# EAGLE design 20w_Adapter (EAGLE 9.4.2)
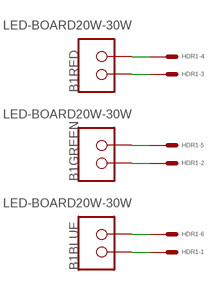
[diagram p0: schematic, sheet 1]

## Parts
B1  LED-BOARD20W-30W  [LED_BOARD_LRG]
HDR1  M06LOCK  [1X06_LOCK]

## Nets
N$1: B1.R- B1.R-@1 HDR1.4
N$2: B1.R+ B1.R+@1 HDR1.3
N$3: B1.G- B1.G-@1 HDR1.5
N$4: B1.G+ B1.G+@1 HDR1.2
N$5: B1.B- B1.B-@1 HDR1.6
N$6: B1.B+ B1.B+@2 HDR1.1

## Library data of the parts
B1 = myBoards:LED-BOARD
HDR1 = headers:M06: Header 6 Standard 6-pin 0.1" header. Use with straight break away headers (SKU : PRT-00116), right angle break away headers (PRT-00553), swiss pins (PRT-00743), machine pins (PRT-00117), and female headers (PRT-00115). Molex polarized connector foot print use with SKU : PRT-08094 with associated crimp pins and housings. NOTES ON THE VARIANTS LOCK and LOCK_LONGPADS... This footprint was designed to help hold the alignment of a through-hole component (i.e. 6-pin header) while soldering it into place. You may notice that each hole has been shifted either up or down by 0.005 of an inch from it's more standard position (which is a perfectly straight line). This slight alteration caused the pins (the squares in the middle) to touch the edges of the holes. Because they are alternating, it causes a "brace" to hold the component in place. 0.005 has proven to be the perfect amount of "off-center" position when using our standard breakaway headers. Although looks a little odd when you look at the bare footprint, once you have a header in there, the alteration is very hard to notice. Also, if you push a header all the way into place, it is covered up entirely on the bottom side. This idea of altering the position of holes to aid alignment will be further integrated into the Sparkfun Library for other footprints. It can help hold any component with 3 or more connection pins.

## Board
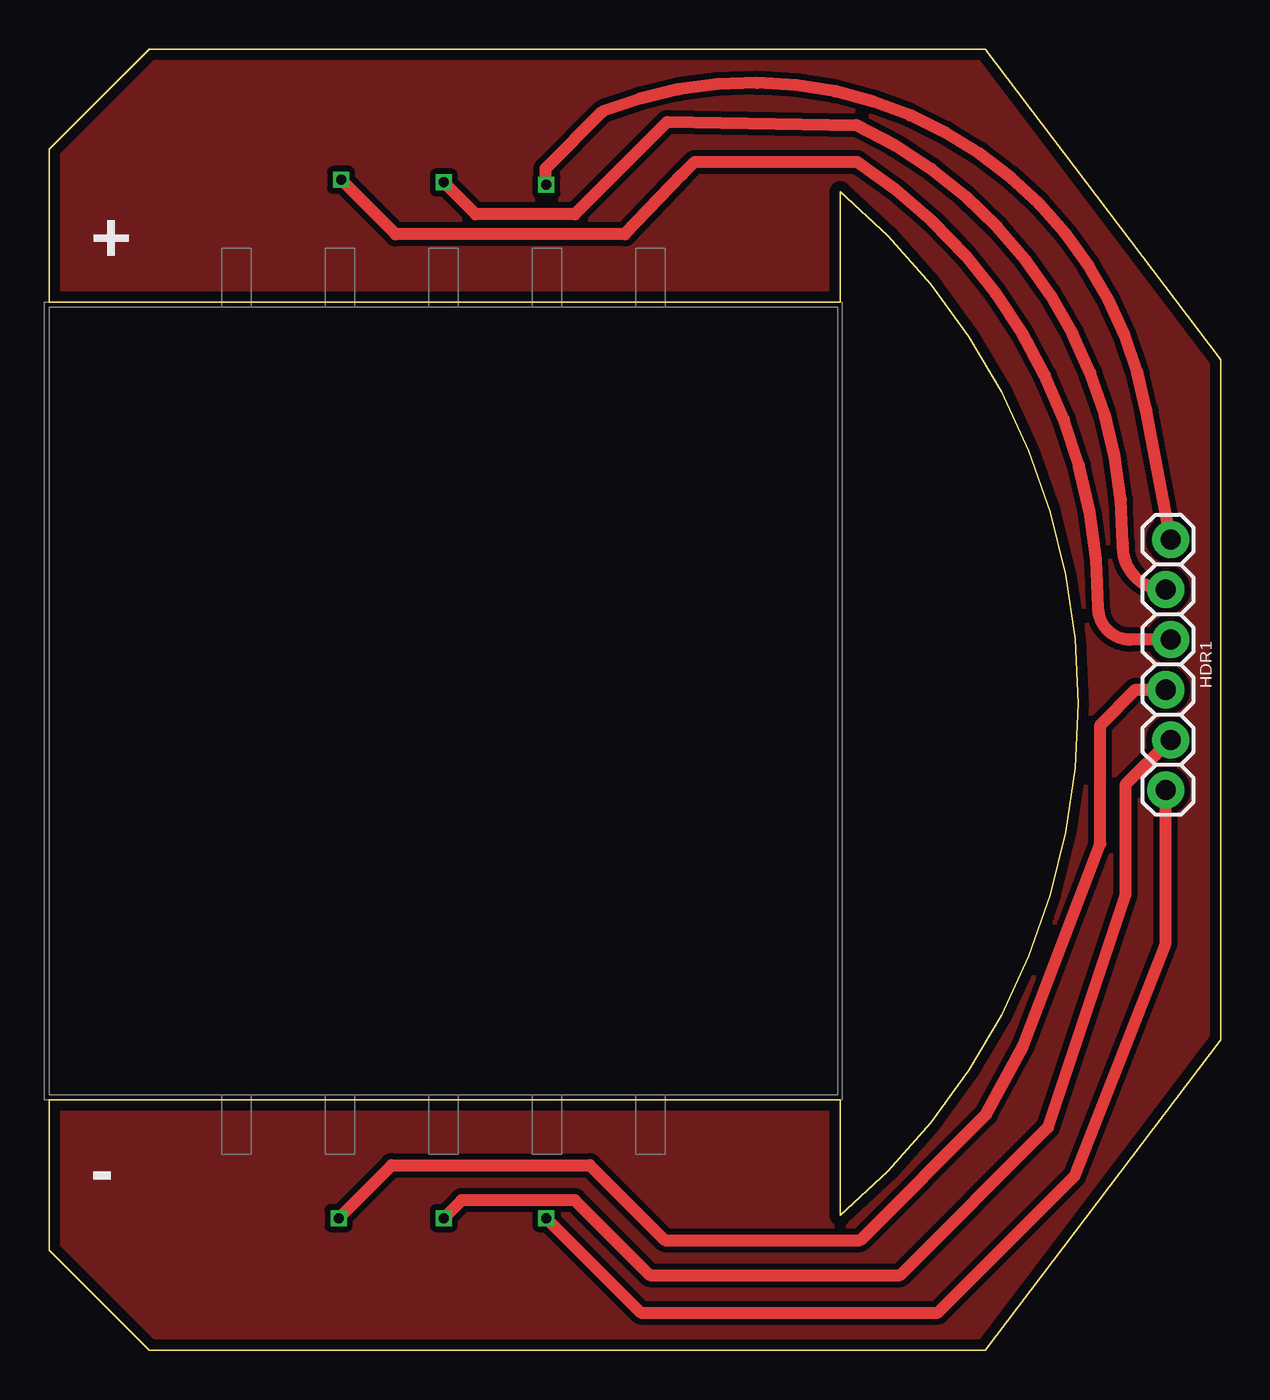
[diagram p1: board, top side]
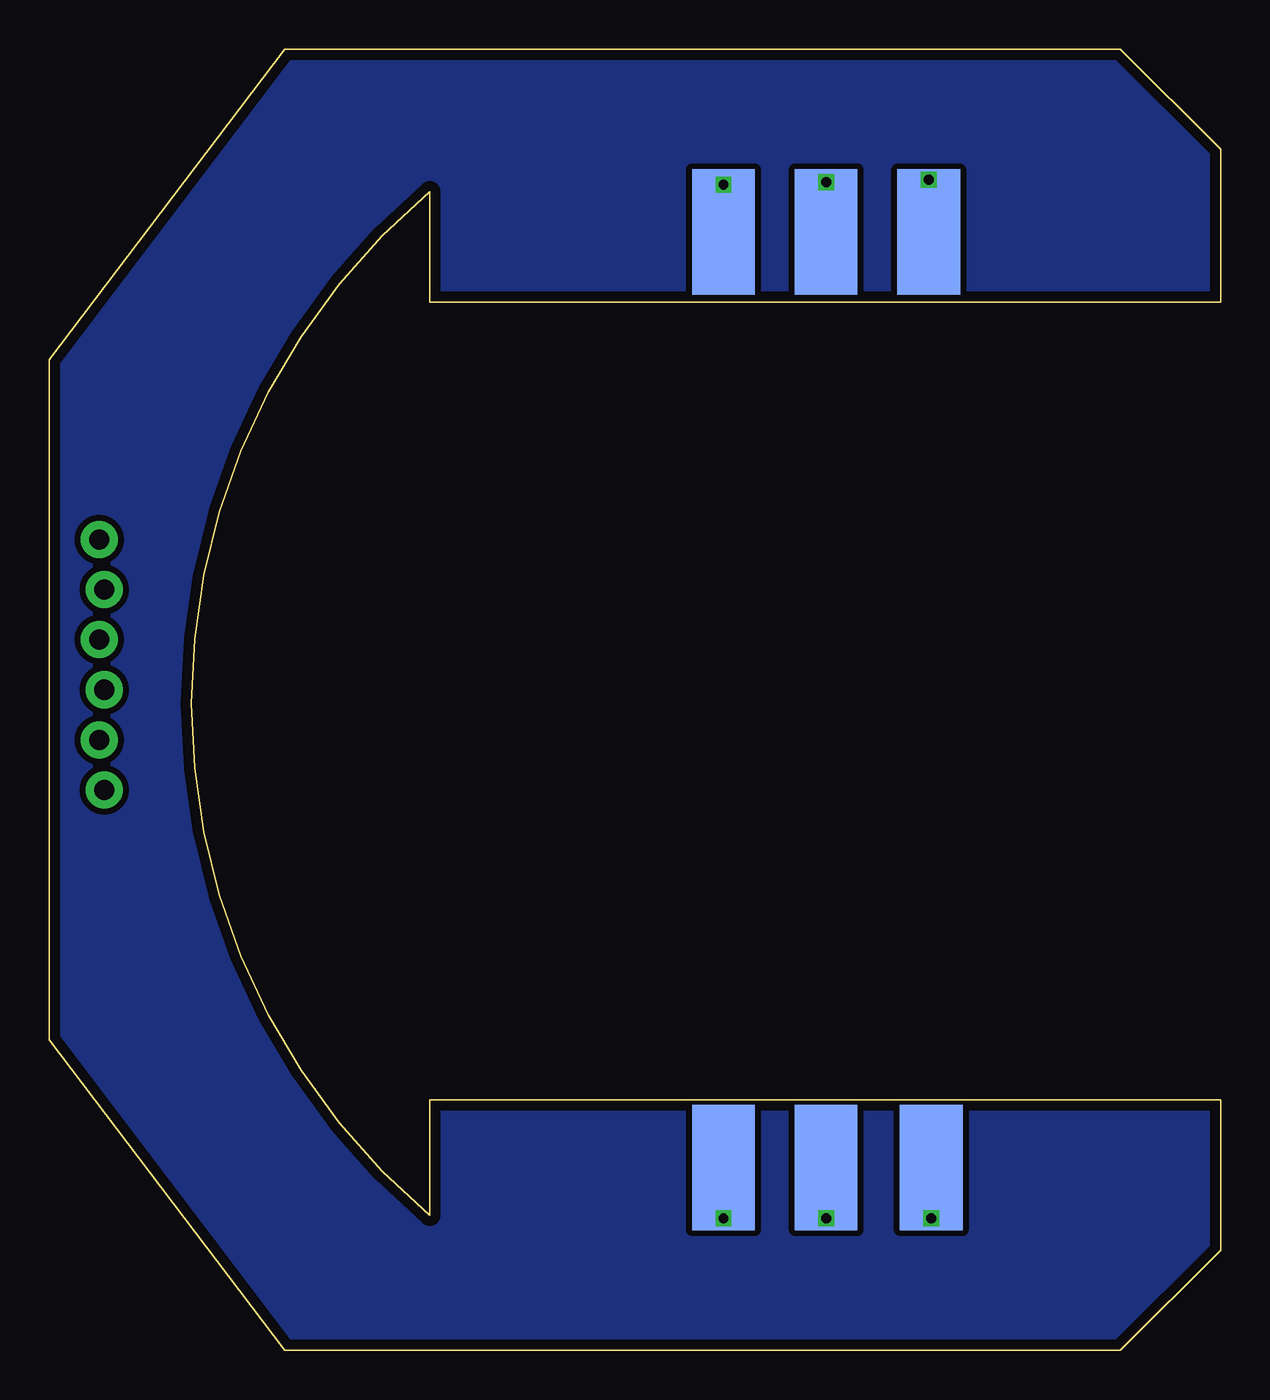
[diagram p2: board, bottom side, seen from below]

Size 59.44 x 66.04 mm. Coordinates in mm from the lower left corner, seen from the top.
Outline: 5.08,0 0,5.08 0,12.7 40.13,12.7 40.13,6.86 arc100 40.13,58.8 40.13,53.21 0,53.21 0,60.96 5.08,66.04 47.5,66.04 59.44,50.29 59.44,15.75 47.5,0 5.08,0
Copper layers (1*16): Top 0.035mm / dielectric 1.6mm / Bottom 0.035mm
Design rules "Elecrow_2-layer_PCB_eagle_rule": minimum track width 6mil, minimum drill 12mil, track to track 6mil, track to pad 6mil, pad to pad 6mil, via to via 8mil, smd to smd 6mil, copper to edge 20mil, drill to drill 10mil, minimum pad ring 6mil, minimum via ring 6mil, stop-mask expansion 0mil, vias tented up to drill 100mil, thermal gap 10mil

### Footprints (pad centres in the part's own frame; a part is rotated, then mirrored left to right if it is on the bottom)
LED_BOARD_LRG = smd 3.175 x 6.35 bottom: B+ 25.222,56.769; B- 25.222,9.271; G+ 20.015,56.769; G- 20.015,9.271; R+ 14.808,56.769; R- 14.681,9.271 | drill 0.5 square: B+@2 25.222,59.157; B-@1 25.222,6.706; G+@1 20.015,59.284; G-@1 20.015,6.706; R+@1 14.808,59.411; R-@1 14.681,6.706
1X06_LOCK = drill 1.016 pad 1.88: 1 -6.35,0; 2 -3.81,-0.254; 3 -1.27,0; 4 1.27,-0.254; 5 3.81,0; 6 6.35,-0.254

### Placement (x,y rotation side)
B1  0,0 0 top
HDR1  56.9,34.8 270 top

### Tracks (layer width: path | path; a pad name or v marks a point on that pad's centre or on a via)
GND
  pour Top (isolate 0.305): 5.08,0 0,5.08 0,12.7 40.13,12.7 40.13,6.86 43.05,9.65 44.7,11.43 45.72,12.83 46.61,14.1 48.77,17.91 49.78,20.32 50.55,22.23 51.56,26.04 51.94,28.96 52.2,31.24 52.2,35.18 51.94,37.72 50.93,42.16 50.04,44.83 48.64,48.01 47.62,49.78 45.59,52.96 43.69,55.37 40.51,58.55 40.13,58.8 40.13,53.21 0,53.21 0,60.96 5.08,66.04 47.5,66.04 59.44,50.42 59.44,15.49 47.5,0
  pour Bottom (isolate 0.305): 5.08,0 0,5.08 0,12.7 40.13,12.7 40.13,6.86 43.05,9.65 44.7,11.43 45.72,12.83 46.61,14.1 48.77,17.91 49.78,20.32 50.55,22.23 51.56,26.04 51.94,28.96 52.2,31.24 52.2,35.18 51.94,37.72 50.93,42.16 50.04,44.83 48.64,48.01 47.62,49.78 45.59,52.96 43.69,55.37 40.51,58.55 40.13,58.8 40.13,53.21 0,53.21 0,60.96 5.21,66.17 47.37,66.17 59.31,50.55 59.44,15.75 47.5,0
N$1
  Top 0.61: B1.R-@1 17.37,9.4 27.43,9.4 31.24,5.59 41.15,5.59 47.56,12 49.41,15.46 53.34,25.7 53.34,31.75 55.12,33.53 HDR1.4
  Bottom 0.61: B1.R- B1.R-@1
N$2
  Top 0.61: B1.R+@1 17.58,56.64 29.21,56.64 32.13,59.69 32.77,60.33 40.98,60.33 arc-57 53.23,37.71 arc90 54.86,36.07 HDR1.3
  Bottom 0.61: B1.R+ B1.R+@1
N$3
  Top 0.61: B1.G-@1 20.93,7.62 26.67,7.62 30.48,3.81 43.18,3.81 50.67,11.3 54.61,23.11 54.61,28.7 HDR1.5
  Bottom 0.61: B1.G- B1.G-@1
N$4
  Top 0.61: B1.G+@1 21.64,57.66 26.67,57.66 31.36,62.35 40.94,62.19 arc-65 54.48,40.95 54.48,40.77 arc90 HDR1.2
  Bottom 0.61: B1.G+ B1.G+@1
N$5
  Top 0.61: B1.B-@1 30.02,1.91 45.09,1.91 52.01,8.83 56.64,20.69 HDR1.6
  Bottom 0.61: B1.B- B1.B-@1
N$6
  Top 0.61: B1.B+@2 25.18,59.98 28.09,62.89 arc-101 55.67,47.7 HDR1.1
  Bottom 0.61: B1.B+ B1.B+@2